# Altium schematic sheet Ethernet.SchDoc
size A; SheetNumber: 4; SheetTotal: 5
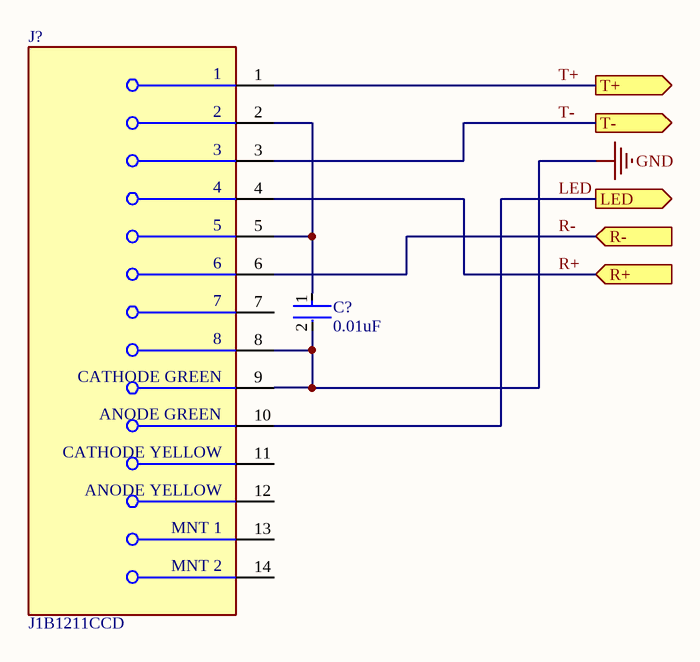
[diagram p0: Ethernet.SchDoc]

## Parts
C?  0.01uF  [FP-GCM21B-0_15-IPC_C]
J?  J1B1211CCD  [FP-J1B1211CCD-MFG]

## Ports
LED (out, see Main_Sheet[3A], Microcontroller[4C]), R+ (in, see Main_Sheet[3A], Microcontroller[4C]), R- (in, see Main_Sheet[3A], Microcontroller[4C]), T+ (out, see Main_Sheet[3B], Microcontroller[4C]), T- (out, see Main_Sheet[3B], Microcontroller[4C])

## Nets
GND: C?.2 J?.8 J?.9(CATHODE_GREEN)
LED: J?.10(ANODE_GREEN) ; port LED
R+: J?.4 ; port R+
R-: J?.6 ; port R-
T+: J?.1 ; port T+
T-: J?.3 ; port T-
NetC?_1: C?.1 J?.2 J?.5

Not connected (* = marked no-connect by the designer): J? 7 11(CATHODE_YELLOW) 12(ANODE_YELLOW) 13(MNT_1) 14(MNT_2)

## Library data of the parts
C? = CMP-06035-043554-1: Ceramic Capacitor for Automotive 10nF ±1% 50VDC X8G 0805 Embossed T/R (GCM21B5G1H103FA16K)
J? = CMP-240752-000001-1: CONN JACK 1PORT 100 BASE-T PCB; Number of Cores per Jack: 4; Direction: Down; Connector Type: RJ45; Shielding: Shielded; Number of Ports: 1; Termination: Solder; Packaging: Bulk; Contact Material: Brass; Color: Green; Number of Rows: 1; Mount: Through Hole; Series: -; Contact Plating: Gold; Max Operating Temperature: 85°C; Min Operating Temperature: -40°C; Housing Material: Thermoplastic